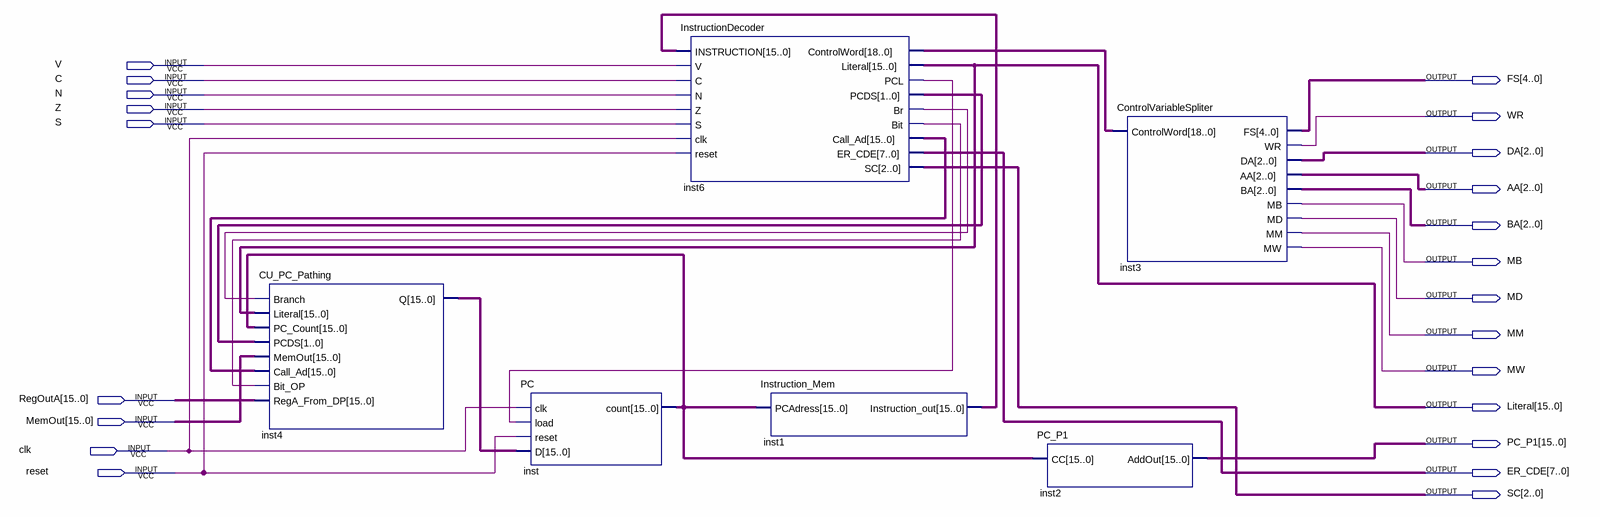
[diagram p0: schematic sheet]
// Quartus schematic Control_Unit.bdf as structural Verilog: 6 symbols, 22 pins
module Control_Unit (
  input  V,
  input  C,
  input  N,
  input  Z,
  input  S,
  input  [15:0] RegOutA,
  input  [15:0] MemOut,
  input  clk,
  input  reset,
  output [4:0] FS,
  output WR,
  output [2:0] DA,
  output [2:0] AA,
  output [2:0] BA,
  output MB,
  output MD,
  output MM,
  output MW,
  output [15:0] Literal,
  output [15:0] PC_P1,
  output [7:0] ER_CDE,
  output [2:0] SC
);

  wire inst6_bit, inst6_br, inst6_pcl;
  wire [1:0] inst6_pcds;
  wire [15:0] inst1_instruction_out, inst4_q, inst6_call_ad, inst_count;
  wire [18:0] inst6_controlword;

  CU_PC_Pathing inst4 (
    .Branch(inst6_br), .Literal(Literal), .PC_Count(inst_count), .PCDS(inst6_pcds), .MemOut(MemOut),
    .Call_Ad(inst6_call_ad), .Bit_OP(inst6_bit), .RegA_From_DP(RegOutA), .Q(inst4_q));
  PC inst (.clk(clk), .load(inst6_pcl), .reset(reset), .D(inst4_q), .count(inst_count));
  InstructionDecoder inst6 (
    .INSTRUCTION(inst1_instruction_out), .V(V), .C(C), .N(N), .Z(Z), .S(S), .clk(clk), .reset(reset),
    .ControlWord(inst6_controlword), .Literal(Literal), .PCL(inst6_pcl), .PCDS(inst6_pcds), .Br(inst6_br),
    .Bit(inst6_bit), .Call_Ad(inst6_call_ad), .ER_CDE(ER_CDE), .SC(SC));
  Instruction_Mem inst1 (.PCAdress(inst_count), .Instruction_out(inst1_instruction_out));
  PC_P1 inst2 (.CC(inst_count), .AddOut(PC_P1));
  ControlVariableSpliter inst3 (
    .ControlWord(inst6_controlword), .FS(FS), .WR(WR), .DA(DA), .AA(AA), .BA(BA), .MB(MB), .MD(MD), .MM(MM),
    .MW(MW));
endmodule
